# Altium project IncuNest.PrjPcb
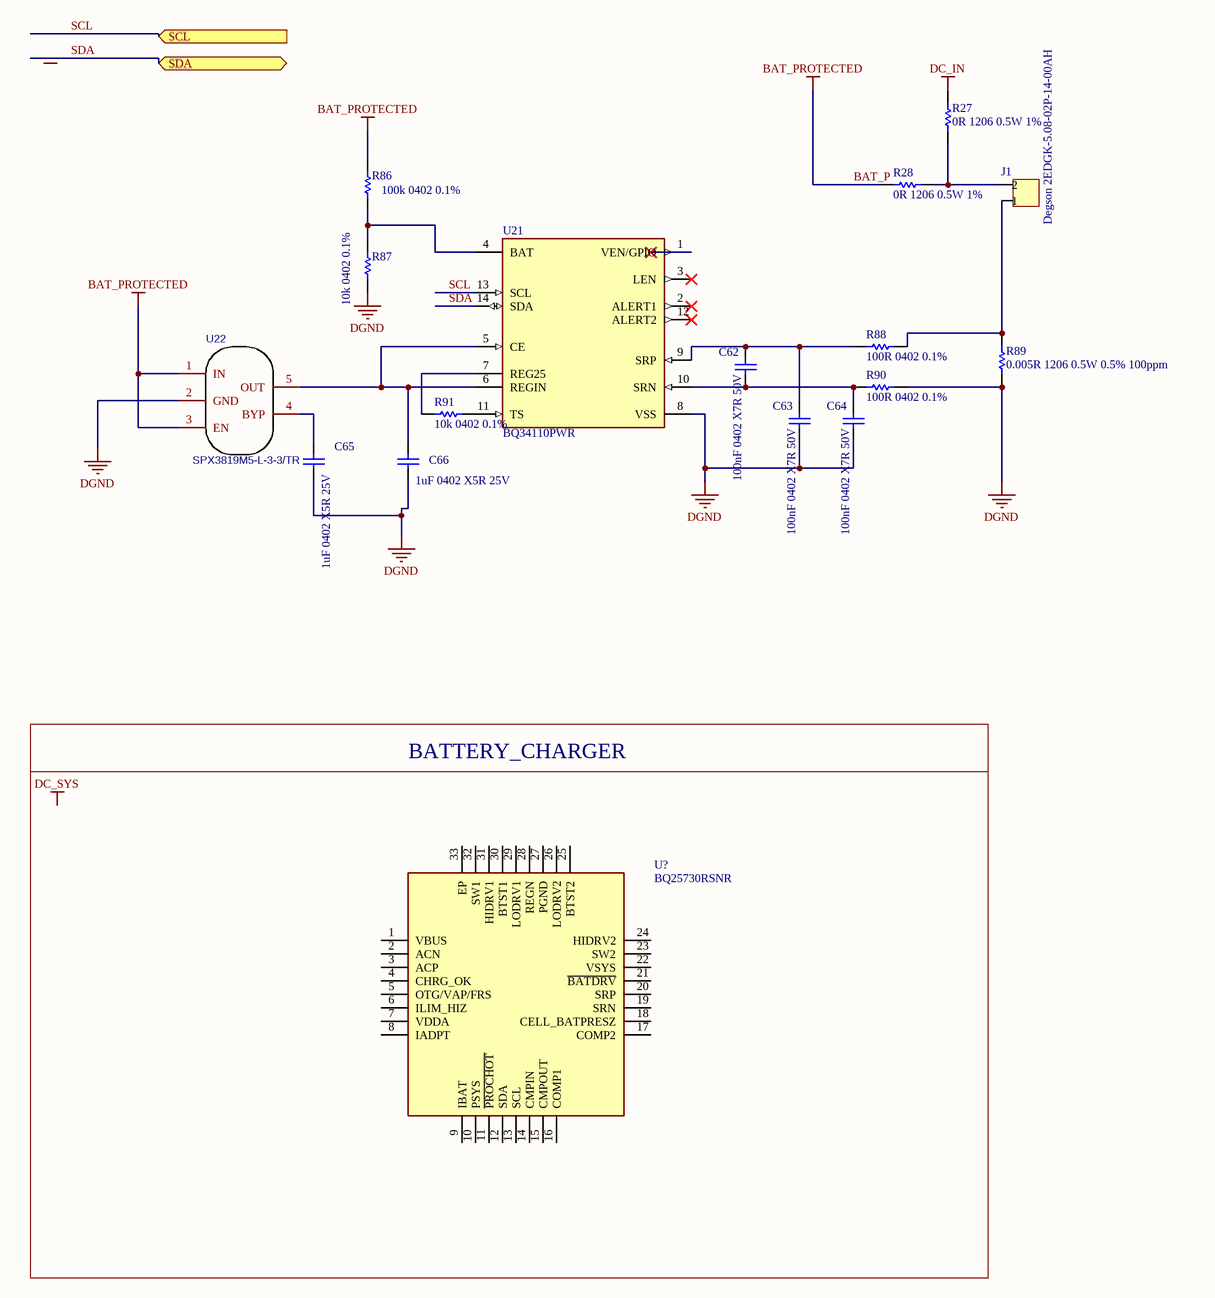
[diagram p0: Battery.SchDoc]
Author_in3: Pablo Sanchez Bergasa; SheetTotal_in3: 10
6 sheets, 122 parts. Net scope: flat (ports and power ports of the same name join across sheets).
Board file: Motherboard.PcbDoc
Sheets:
  Battery.SchDoc
  Power_management.SchDoc
  AFE.SchDoc
  GSM.SchDoc
  Sensors.SchDoc
  Display.SchDoc

## Sheet Battery.SchDoc: Power
size A3; SheetNumber: 4; SheetTotal: 11

### Parts
(Parts that share a designator on the sheet are numbered #1, #2 ... from top to bottom, then left to right.)
C62  100nF 0402 X7R 50V  [CAPC1005X55X25NL5T10]
C63  100nF 0402 X7R 50V  [CAPC1005X55X25NL5T10]
C64  100nF 0402 X7R 50V  [CAPC1005X55X25NL5T10]
C65  1uF 0402 X5R 25V  [CAPC1005X55X25NL5T10]
C66  1uF 0402 X5R 25V  [CAPC1005X55X25NL5T10]
J1  Degson 2EDGK-5.08-02P-14-00AH  [PCB-h4cyb3wxd4gf7j132tzl-1]
R27  0R 1206 0.5W 1%  [CAPC3216X180X55ML20T25]
R28  0R 1206 0.5W 1%  [CAPC3216X180X55ML20T25]
R86  100k 0402 0.1%  [RESC1005X40X25ML05T10]
R87  10k 0402 0.1%  [RESC1005X40X25ML05T10]
R88  100R 0402 0.1%  [RESC1005X40X25ML05T10]
R89  0.005R 1206 0.5W 0.5% 100ppm  [CAPC3216X180X55ML20T25]
R90  100R 0402 0.1%  [RESC1005X40X25ML05T10]
R91  10k 0402 0.1%  [RESC1005X40X25ML05T10]
U21  BQ34110PWR  [FP-PW0014A-MFG]
U22  SPX3819M5-L-3-3/TR  [SOT-23-5_L3.0-W1.7-P0.95-LS2.8-BR]
U?#1  BQ25730RSNR  [QFN40P400X400X80-33N-D]

### Blocks framed on the sheet
BATTERY_CHARGER: U?#1

### Ports
SCL (in), SDA (bidir)

### Nets
BAT_P: R28.1 R86.2 U22.1(IN) U22.3(EN)  [also labelled BAT_PROTECTED]
DC_IN: R27.1
DGND: C63.1 C64.1 C65.1 C66.1 R87.1 R89.2 R90.1 U21.8(VSS) U22.2(GND)
SCL: U21.13(SCL) ; port SCL
SDA: U21.14(SDA) ; port SDA
NetC62_1: C62.1 C64.2 R90.2 U21.10(SRN)
NetC62_2: C62.2 C63.2 R88.2 U21.9(SRP)
NetC65_2: C65.2 U22.4(BYP)
NetC66_2: C66.2 U21.5(CE) U21.6(REGIN) U22.5(OUT)
NetJ1_1: J1.1 R88.1 R89.1
NetJ1_2: J1.2 R27.2 R28.2
NetR86_1: R86.1 R87.2 U21.4(BAT)
NetR91_1: R91.1 U21.11(TS)
NetR91_2: R91.2 U21.7(REG25)

Not connected (* = marked no-connect by the designer): U21 1(VEN/GPIO)* 2(ALERT1)* 3(LEN)* 12(ALERT2)*; U?#1 1(VBUS) 2(ACN) 3(ACP) 4(CHRG_OK) 5(OTG/VAP/FRS) 6(ILIM_HIZ) 7(VDDA) 8(IADPT) 9(IBAT) 10(PSYS) 11(~{PROCHOT}) 12(SDA) 13(SCL) 14(CMPIN) 15(CMPOUT) 16(COMP1) 17(COMP2) 18(CELL_BATPRESZ) 19(SRN) 20(SRP) 21(~{BATDRV}) 22(VSYS) 23(SW2) 24(HIDRV2) 25(BTST2) 26(LODRV2) 27(PGND) 28(REGN) 29(LODRV1) 30(BTST1) 31(HIDRV1) 32(SW1) 33(EP)

### Notes on the sheet
- Labels drawn without touching a wire or pin: DC_SYS
- Title
- Size:
- Date:
- A3
- Author:
- Time:
- Revision:
- Sheet
- of
- File:

### Library data of the parts
C62-C66 = CMP-1662-00020-1: ComponentLink2Description: Datasheet; ComponentLink2URL: http://psearch.en.murata.com/capacitor/product/GRM155R60J105KE19%23.pdf; ComponentLink1Description: Manufacturer URL; ComponentLink1URL: http://www.murata.com/
  C62-C64: LCSC_PN: C77020
  C65 C66: LCSC_PN: C77009
J1 = CMP-7a42b7ee166ba585-1: Terminal block, 5mm 2 Pos, through hole male.; Manufacturer Part Number: 2EDGK-5.08-02P-14-00AH + 2EDGVC-5.08-02P; Octopart URL: https://octopart.com/2edgk-5.08-02p-14-00ah-degson-78006607; OctopartID: 7a42b7ee166ba585; Manufacturer Part Number 2: WJ2EDGVC-5.08-2P + WJ2EDGK-5.08-2P; LCSC Part: C8445; LCSC_PN: C8445
R27 R28 = CMP-0abdc173b10ad57a-1: Manufacturer Part Number: WSLP12065L000FEA; Resistance: 0,002; Power: 1W; Octopart URL: https://octopart.com/1-2176055-0-te+connectivity-46440145; Case/Package: 1206; Lifecycle Status: Not Listed by Manufacturer; Packaging: Tape & Reel (TR); OctopartID: 0abdc173b10ad57a; OrderingCode: WSLP12065L000FEA; Manufacturer Part Number 2: FMF06FTHR005-LHL; LCSC_PN: C108081
R86-R88 R90 R91 = CMP-2002-07472-1
  R86: LCSC_PN: C60491
  R87 R91: LCSC_PN: C190095
  R88 R90: LCSC_PN: C106233
R89 = CMP-0abdc173b10ad57a-1: 0.002R 1206 0.5W 1%; Manufacturer Part Number: WSLP12065L000FEA; Resistance: 0,005; Power: 1W; Octopart URL: https://octopart.com/1-2176055-0-te+connectivity-46440145; Case/Package: 1206; Lifecycle Status: Not Listed by Manufacturer; Packaging: Tape & Reel (TR); OctopartID: 0abdc173b10ad57a; OrderingCode: WSLP12065L000FEA; Manufacturer Part Number 2: FMF06FTHR005-LHL; LCSC_PN: C723507
U21 = CMP-04911-000003-1: IC BATT MON MULTICELL 14TSSOP; Manufacturer: Texas Instruments; Number Of Outputs: 2; Max Junction Temp: +100°C; Max Supply Voltage: 4.5V; Min Supply Voltage: 2.45V; Number Of Cells: 4; Standoff Height: 0.05mm; Nominal Supply Current: 133uA; Package: PW0014A; Temperature Range High: +85°C; Octopart: https://octopart.com/bq34110pwr-texas+instruments-75529711; ComponentLink2URL: https://www.ti.com/lit/ds/symlink/bq34110.pdf; Device Class L1: Integrated Circuits (ICs); Height: 1.2mm; Device Class L3: Battery Management; Temperature Range Low: -40°C; RoHS: TRUE; Digikey Description: IC BATT MON MULTICELL 14TSSOP; Device Class L2: Power Management ICs; Manufacturer Part Number: BQ34110PWR; Lead Free: Yes; ComponentLink2Description: Datasheet; Category: IC; Automotive: No; Mouser Description: Multi-Chemistry High-Cell Count Battery Fuel Gauge With Integrated Rarely Discharged Module 14-TSSOP -40 to 85; Temperature: -40°C to +85°C; Ambient Temperature Range Low: -40°C; Ambient Temperature Range High: +85°C; LCSC_PN: C2877075
U22 = SPX3819M5-L-3-3/TR: BOM_Manufacturer: EXAR; BOM_Supplier: LCSC; BOM_Manufacturer Part: SPX3819M5-L-3-3/TR; BOM_Supplier Part: C9055; BOM_JLCPCB Part Class: Extended Part; spicePre: U; spiceSymbolName: SPX3819M5-L-3-3/TR; LCSC_PN: C9055
U?#1 = BQ25730RSNR: Integrated Circuit; Manufacturer_Name: Texas Instruments; Datasheet Link: https://www.ti.com/lit/ds/symlink/bq25730.pdf?ts=1623420063043&ref_url=https%253A%252F%252Fwww.ti.com%252Fstore%252Fti%252Fen%252Fp%252Fproduct%252F%253Fp%253DBQ25730RSNR; Height: 0.8mm; Manufacturer_Part_Number: BQ25730RSNR; Mouser Part Number: 595-BQ25730RSNR; Mouser Price/Stock: https://www.mouser.co.uk/ProductDetail/Texas-Instruments/BQ25730RSNR?qs=stqOd1AaK78USmb51n%2Fwlg%3D%3D; Arrow Part Number: BQ25730RSNR; Arrow Price/Stock: https://www.arrow.com/en/products/bq25730rsnr/texas-instruments?region=nac

## Sheet Power_management.SchDoc: Power
size A3; SheetNumber: 4; SheetTotal: 10
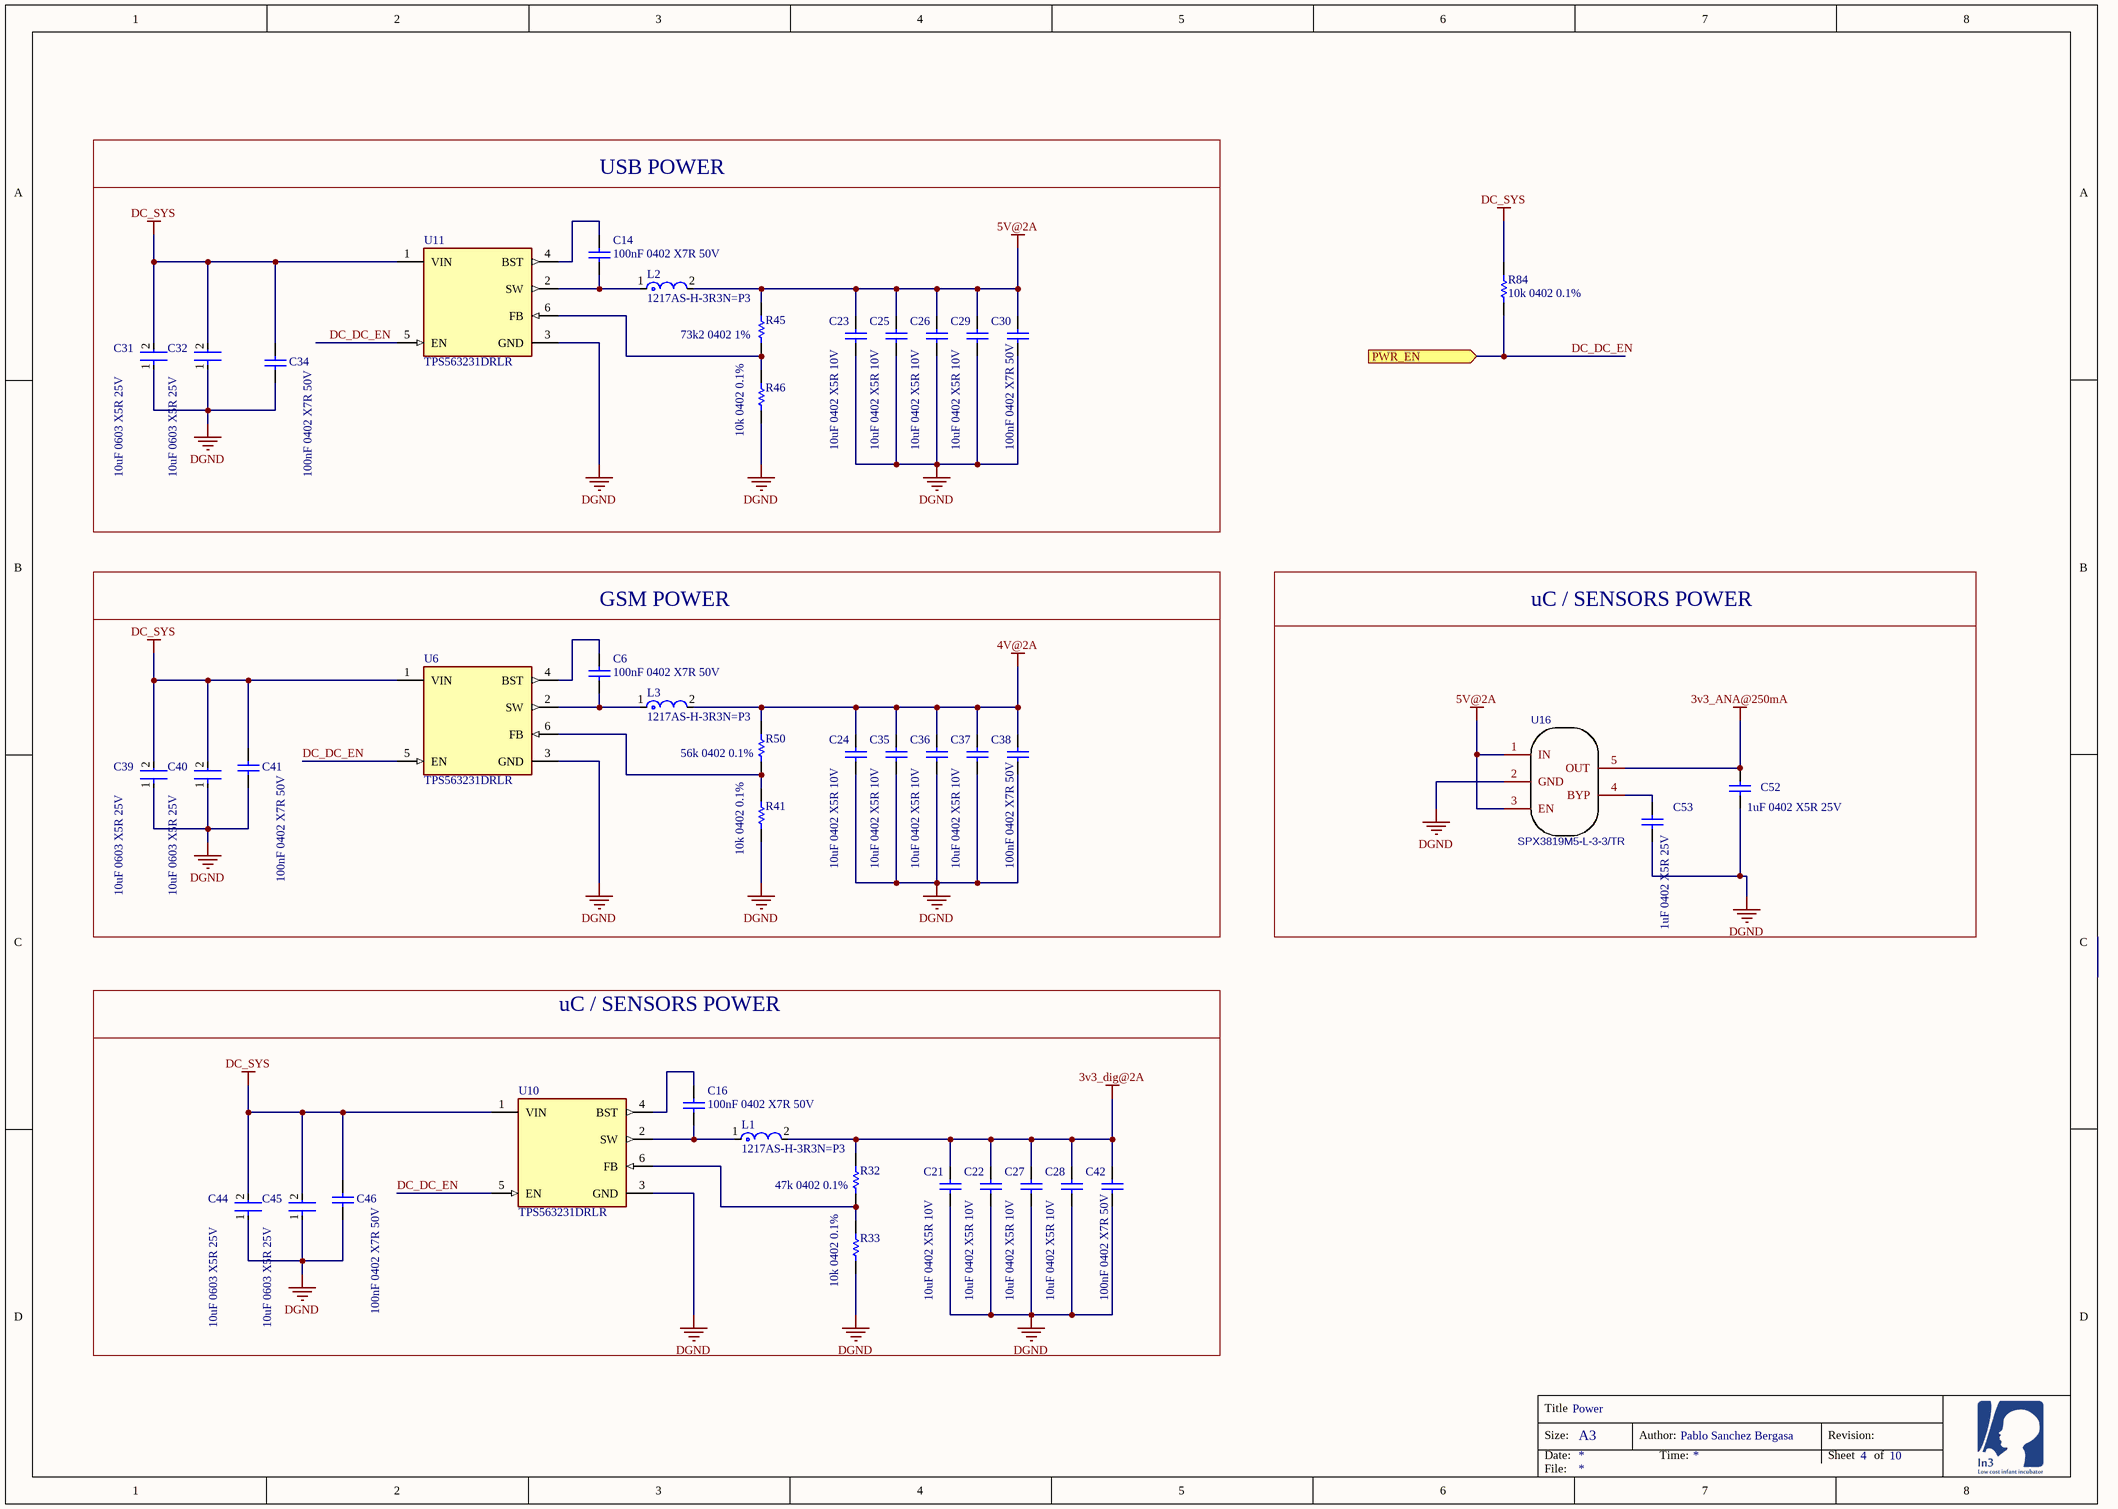
[diagram p1: Power_management.SchDoc]

### Parts
C6  100nF 0402 X7R 50V  [CAPC1005X55X25NL5T10]
C14  100nF 0402 X7R 50V  [CAPC1005X55X25NL5T10]
C16  100nF 0402 X7R 50V  [CAPC1005X55X25NL5T10]
C21  10uF 0402 X5R 10V  [CAPC1005X55X25NL5T10]
C22  10uF 0402 X5R 10V  [CAPC1005X55X25NL5T10]
C23  10uF 0402 X5R 10V  [CAPC1005X55X25NL5T10]
C24  10uF 0402 X5R 10V  [CAPC1005X55X25NL5T10]
C25  10uF 0402 X5R 10V  [CAPC1005X55X25NL5T10]
C26  10uF 0402 X5R 10V  [CAPC1005X55X25NL5T10]
C27  10uF 0402 X5R 10V  [CAPC1005X55X25NL5T10]
C28  10uF 0402 X5R 10V  [CAPC1005X55X25NL5T10]
C29  10uF 0402 X5R 10V  [CAPC1005X55X25NL5T10]
C30  100nF 0402 X7R 50V  [CAPC1005X55X25NL5T10]
C31  10uF 0603 X5R 25V  [FP-GRM188-0_2-IPC_B]
C32  10uF 0603 X5R 25V  [FP-GRM188-0_2-IPC_B]
C34  100nF 0402 X7R 50V  [CAPC1005X55X25NL5T10]
C35  10uF 0402 X5R 10V  [CAPC1005X55X25NL5T10]
C36  10uF 0402 X5R 10V  [CAPC1005X55X25NL5T10]
C37  10uF 0402 X5R 10V  [CAPC1005X55X25NL5T10]
C38  100nF 0402 X7R 50V  [CAPC1005X55X25NL5T10]
C39  10uF 0603 X5R 25V  [FP-GRM188-0_2-IPC_B]
C40  10uF 0603 X5R 25V  [FP-GRM188-0_2-IPC_B]
C41  100nF 0402 X7R 50V  [CAPC1005X55X25NL5T10]
C42  100nF 0402 X7R 50V  [CAPC1005X55X25NL5T10]
C44  10uF 0603 X5R 25V  [FP-GRM188-0_2-IPC_B]
C45  10uF 0603 X5R 25V  [FP-GRM188-0_2-IPC_B]
C46  100nF 0402 X7R 50V  [CAPC1005X55X25NL5T10]
C52  1uF 0402 X5R 25V  [CAPC1005X55X25NL5T10]
C53  1uF 0402 X5R 25V  [CAPC1005X55X25NL5T10]
L1  1217AS-H-3R3N=P3  [FP-DEM8045C-MFG]
L2  1217AS-H-3R3N=P3  [FP-DEM8045C-MFG]
L3  1217AS-H-3R3N=P3  [FP-DEM8045C-MFG]
R32  47k 0402 0.1%  [RESC1005X40X25ML05T10]
R33  10k 0402 0.1%  [RESC1005X40X25ML05T10]
R41  10k 0402 0.1%  [RESC1005X40X25ML05T10]
R45  73k2 0402 1%  [RESC1005X40X25ML05T10]
R46  10k 0402 0.1%  [RESC1005X40X25ML05T10]
R50  56k 0402 0.1%  [RESC1005X40X25ML05T10]
R84  10k 0402 0.1%  [RESC1005X40X25ML05T10]
U6  TPS563231DRLR  [FP-DRL0006A-MFG]
U10  TPS563231DRLR  [FP-DRL0006A-MFG]
U11  TPS563231DRLR  [FP-DRL0006A-MFG]
U16  SPX3819M5-L-3-3/TR  [SOT-23-5_L3.0-W1.7-P0.95-LS2.8-BR]

### Blocks framed on the sheet
USB POWER: C14 C23 C25 C26 C29-C32 C34 L2 R45 R46 U11
GSM POWER: C6 C24 C35-C41 L3 R41 R50 U6
uC / SENSORS POWER: C52 C53 U16
uC / SENSORS POWER: C16 C21 C22 C27 C28 C42 C44-C46 L1 R32 R33 U10

### Ports
PWR_EN (in)

### Nets
3v3_ANA@250mA: C52.2 U16.5(OUT)
3v3_dig@2A: C21.2 C22.2 C27.2 C28.2 C42.2 L1.2 R32.2
4V@2A: C24.2 C35.2 C36.2 C37.2 C38.2 L3.2 R50.2
5V@2A: C23.2 C25.2 C26.2 C29.2 C30.2 L2.2 R45.2 U16.1(IN) U16.3(EN)
DC_SYS: C31.2 C32.2 C34.2 C39.2 C40.2 C41.2 C44.2 C45.2 C46.2 R84.1 U6.1(VIN) U10.1(VIN) U11.1(VIN)
DGND: C21.1 C22.1 C23.1 C24.1 C25.1 C26.1 C27.1 C28.1 C29.1 C30.1 C31.1 C32.1 C34.1 C35.1 C36.1 C37.1 C38.1 C39.1 C40.1 C41.1 C42.1 C44.1 C45.1 C46.1 C52.1 C53.1 R33.1 R41.1 R46.1 U6.3(GND) U10.3(GND) U11.3(GND) U16.2(GND)
DC_DC_EN: R84.2 U6.5(EN) U10.5(EN) U11.5(EN) ; port PWR_EN
NetC6_1: C6.1 L3.1 U6.2(SW)
NetC6_2: C6.2 U6.4(BST)
NetC14_1: C14.1 L2.1 U11.2(SW)
NetC14_2: C14.2 U11.4(BST)
NetC16_1: C16.1 L1.1 U10.2(SW)
NetC16_2: C16.2 U10.4(BST)
NetC53_2: C53.2 U16.4(BYP)
NetR32_1: R32.1 R33.2 U10.6(FB)
NetR41_2: R41.2 R50.1 U6.6(FB)
NetR45_1: R45.1 R46.2 U11.6(FB)

### Notes on the sheet
- Title
- Size:
- Date:
- A3
- Author:
- Time:
- Revision:
- Sheet
- of
- File:

### Library data of the parts
C6 C14 C16 C21-C30 C34-C38 C41 C42 C46 C52 C53 = CMP-1662-00020-1: ComponentLink2Description: Datasheet; ComponentLink2URL: http://psearch.en.murata.com/capacitor/product/GRM155R60J105KE19%23.pdf; ComponentLink1Description: Manufacturer URL; ComponentLink1URL: http://www.murata.com/
  C6 C14 C16 C30 C34 C38 C41 C42 C46: LCSC_PN: C77020
  C21-C29 C35-C37: LCSC_PN: C77000
  C52 C53: LCSC_PN: C77009
C31 C32 C39 C40 C44 C45 = CMP-06035-022879-1: LCSC_PN: C91606
L1-L3 = CMP-06042-006799-1: Shielded Wirewound Inductor 3.3uH 30% 6800mA 0.0144Ω SMD; Saturation Current: 7.7A; Core Material: Ferrite; Current Rating: 6.8A; Test Frequency: 100kHz; DC Resistance (DCR): 14.4mR; Height - Seated (Max): 0.177inch; Packaging: Tape and Reel; Resistor Type: Wirewound; Tolerance: 30%; Inductance: 3.3uH; Length: 0.315inch; Number of Pins: 2; Case/Package: SMD/SMT; Mount: Surface Mount; Max DC Current: 6.8A; Width: 0.315inch; Shielding: Shielded; LCSC_PN: C514864
R32 R33 R41 R46 R50 R84 = CMP-2002-07472-1
  R32: LCSC_PN: C93943
  R33 R41 R46 R84: LCSC_PN: C190095
  R50: LCSC_PN: C114756
R45 = CMP-2002-07472-1: Manufacturer: Yageo / Phycomp; LCSC_PN: C185398
U6 U10 U11 = CMP-04918-000435-1: POWER MANAGEMENT; LCSC_PN: C779412
U16 = SPX3819M5-L-3-3/TR: BOM_Manufacturer: EXAR; BOM_Supplier: LCSC; BOM_Manufacturer Part: SPX3819M5-L-3-3/TR; BOM_Supplier Part: C9055; BOM_JLCPCB Part Class: Extended Part; spicePre: U; spiceSymbolName: SPX3819M5-L-3-3/TR; LCSC_PN: C9055

## Sheet AFE.SchDoc
size A3; SheetNumber: 7; SheetTotal: 10
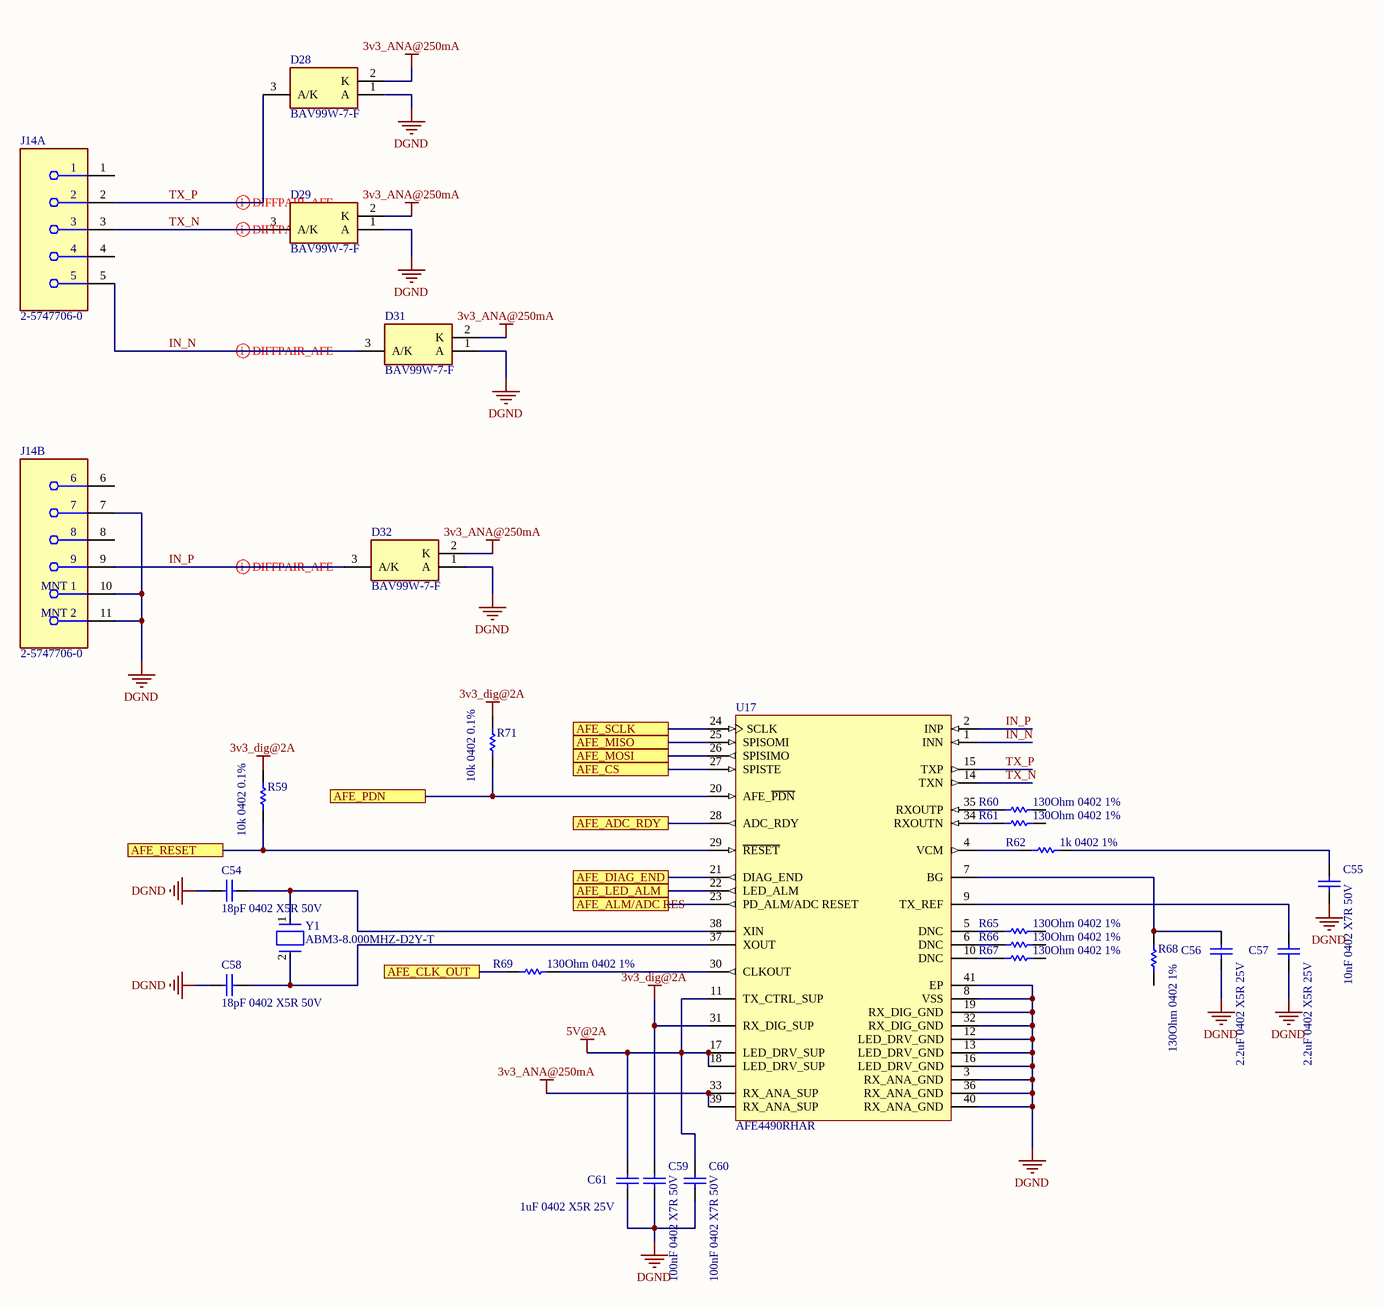
[diagram p2: AFE.SchDoc]

### Parts
C54  18pF 0402 X5R 50V  [CAPC1005X55X25NL5T10]
C55  10nF 0402 X7R 50V  [CAPC1005X55X25NL5T10]
C56  2.2uF 0402 X5R 25V  [CAPC1005X55X25NL5T10]
C57  2.2uF 0402 X5R 25V  [CAPC1005X55X25NL5T10]
C58  18pF 0402 X5R 50V  [CAPC1005X55X25NL5T10]
C59  100nF 0402 X7R 50V  [CAPC1005X55X25NL5T10]
C60  100nF 0402 X7R 50V  [CAPC1005X55X25NL5T10]
C61  1uF 0402 X5R 25V  [CAPC1005X55X25NL5T10]
D28  BAV99W-7-F  [SOT65P210X110-3N]
D29  BAV99W-7-F  [SOT65P210X110-3N]
D31  BAV99W-7-F  [SOT65P210X110-3N]
D32  BAV99W-7-F  [SOT65P210X110-3N]
J14  2-5747706-0  [FP-2-5747706-0-MFG]  (parts A,B of 2)
R59  10k 0402 0.1%  [RESC1005X40X25ML05T10]
R60  130Ohm 0402 1%  [RESC1005X40X25ML05T10]
R61  130Ohm 0402 1%  [RESC1005X40X25ML05T10]
R62  1k 0402 1%  [RESC1005X40X25ML05T10]
R65  130Ohm 0402 1%  [RESC1005X40X25ML05T10]
R66  130Ohm 0402 1%  [RESC1005X40X25ML05T10]
R67  130Ohm 0402 1%  [RESC1005X40X25ML05T10]
R68  130Ohm 0402 1%  [RESC1005X40X25ML05T10]
R69  130Ohm 0402 1%  [RESC1005X40X25ML05T10]
R71  10k 0402 0.1%  [RESC1005X40X25ML05T10]
U17  AFE4490RHAR  [RHA0040B_V]
Y1  ABM3-8.000MHZ-D2Y-T  [FP-ABM3-MFG]

### Ports
AFE_ADC_RDY, AFE_ALM/ADC RES, AFE_CLK_OUT, AFE_CS, AFE_DIAG_END, AFE_LED_ALM, AFE_MISO, AFE_MOSI, AFE_PDN, AFE_RESET, AFE_SCLK

### Nets
3v3_ANA@250mA: D28.2(K) D29.2(K) D31.2(K) D32.2(K) U17.33(RX_ANA_SUP) U17.39(RX_ANA_SUP)
3v3_dig@2A: C59.2 R59.2 R71.2 U17.31(RX_DIG_SUP)
5V@2A: C60.2 C61.2 U17.11(TX_CTRL_SUP) U17.17(LED_DRV_SUP) U17.18(LED_DRV_SUP)
DGND: C54.1 C55.1 C56.1 C57.1 C58.1 C59.1 C60.1 C61.1 D28.1(A) D29.1(A) D31.1(A) D32.1(A) J14.7 J14.10(MNT_1) J14.11(MNT_2) U17.3(RX_ANA_GND) U17.8(VSS) U17.12(LED_DRV_GND) U17.13(LED_DRV_GND) U17.16(LED_DRV_GND) U17.19(RX_DIG_GND) U17.32(RX_DIG_GND) U17.36(RX_ANA_GND) U17.40(RX_ANA_GND) U17.41(EP)
IN_N: D31.3(A/K) J14.5 U17.1(INN)
IN_P: D32.3(A/K) J14.9 U17.2(INP)
TX_N: D29.3(A/K) J14.3 U17.14(TXN)
TX_P: D28.3(A/K) J14.2 U17.15(TXP)
NetC54_2: C54.2 U17.38(XIN) Y1.1
NetC55_2: C55.2 R62.1
NetC56_2: C56.2 R68.2 U17.7(BG)
NetC57_2: C57.2 U17.9(TX_REF)
NetC58_2: C58.2 U17.37(XOUT) Y1.2
NetR59_1: R59.1 U17.29(~{RESET}) ; port AFE_RESET
NetR60_2: R60.2 U17.35(RXOUTP)
NetR61_2: R61.2 U17.34(RXOUTN)
NetR62_2: R62.2 U17.4(VCM)
NetR65_2: R65.2 U17.5(DNC)
NetR66_2: R66.2 U17.6(DNC)
NetR67_2: R67.2 U17.10(DNC)
NetR69_1: R69.1 U17.30(CLKOUT)
NetR69_2: R69.2 ; port AFE_CLK_OUT
NetR71_1: R71.1 U17.20(AFE_~{PDN}) ; port AFE_PDN
NetU17_21: U17.21(DIAG_END) ; port AFE_DIAG_END
NetU17_22: U17.22(LED_ALM) ; port AFE_LED_ALM
NetU17_23: U17.23(PD_ALM/ADC_RESET) ; port AFE_ALM/ADC RES
NetU17_24: U17.24(SCLK) ; port AFE_SCLK
NetU17_25: U17.25(SPISOMI) ; port AFE_MISO
NetU17_26: U17.26(SPISIMO) ; port AFE_MOSI
NetU17_27: U17.27(SPISTE) ; port AFE_CS
NetU17_28: U17.28(ADC_RDY) ; port AFE_ADC_RDY

Not connected (* = marked no-connect by the designer): J14 1 4 6 8; R60 1; R61 1; R65 1; R66 1; R67 1; R68 1

### Layout directives
differential pair; differential pair class AFE: IN_N, IN_P, TX_N, TX_P

### Library data of the parts
C54-C61 = CMP-1662-00020-1: ComponentLink2Description: Datasheet; ComponentLink2URL: http://psearch.en.murata.com/capacitor/product/GRM155R60J105KE19%23.pdf; ComponentLink1Description: Manufacturer URL; ComponentLink1URL: http://www.murata.com/
  C54 C58: LCSC_PN: C33149
  C55: LCSC_PN: C60133
  C56 C57: LCSC_PN: C77002
  C59 C60: LCSC_PN: C77020
  C61: LCSC_PN: C77009
D28 D29 D31 D32 = BAV99W-7-F: Diode; Manufacturer_Name: Diodes Inc.; Datasheet Link: https://www.diodes.com/assets/Datasheets/ds30045.pdf; Height: 1.1mm; Manufacturer_Part_Number: BAV99W-7-F; Mouser Part Number: 621-BAV99W-F; Mouser Price/Stock: https://www.mouser.co.uk/ProductDetail/Diodes-Incorporated/BAV99W-7-F?qs=KrBKXozF1ElcNxS3QKF7wg%3D%3D; Arrow Part Number: BAV99W-7-F; Arrow Price/Stock: https://www.arrow.com/en/products/bav99w-7-f/diodes-incorporated?region=europe; LCSC_PN: C93035
J14 = CMP-03367-000004-1: CONN D-SUB RCPT 9POS VERT SOLDER; Manufacturer: TE Connectivity; Is Female: yes; Conn Orientation: Vertical; Current Rating: 6A; Shielding: true; Number Of Contacts: 9; Conn Gender: Female; Pitch: 2.74mm; RoHS: TRUE; Temperature: -55°C to +105°C; Package: 2-5747706-0; Category: Conn; Automotive: No; Device Class L3: unset; Octopart: https://octopart.com/2-5747706-0-te+connectivity-39499683; Lead Free: Yes; Contact Material: Gold,Nickel; Height: 0.494inch; Temperature Range High: +105°C; Device Class L1: Connectors; ComponentLink2Description: Datasheet; Mouser Description: D-Sub Standard Connectors RECP FRNT MTL SHL 9P retention inserts; ComponentLink2URL: https://www.te.com/commerce/DocumentDelivery/DDEController?Action=showdoc&DocId=Customer+Drawing%7F5747706%7FB%7Fpdf%7FEnglish%7FENG_CD_5747706_B.pdf%7F2-5747706-0; Digikey Description: CONN D-SUB RCPT 9POS VERT SOLDER; Temperature Range Low: -55°C; Manufacturer Part Number: 2-5747706-0; Device Class L2: D-Sub Connectors; LCSC_PN: C189689
R59-R62 R65-R69 R71 = CMP-2002-07472-1
  R59 R71: LCSC_PN: C190095
  R60 R61 R65-R69: LCSC_PN: C413066
  R62: LCSC_PN: C106235
U17 = CMP-0767-00003-2: Integrated Analog Front End for Pulse Oximeter, 2 to 3.6 V Rx, 3 to 5.25 V Tx, -40 to 85 degC, 40-Pin VQFN (RHA), RoHS, Tape and Reel; Manufacturer: Texas Instruments; CMRR: 75 dB; Resolution: 22 Bits; Sample Rate (max): 1.3 KSPS; Packing: RHA0040B; # Input Channels: 1; ComponentLink3Description: Package Specification; ComponentLink2Description: Datasheet; RoHS: TRUE; ComponentLink2URL: http://www.ti.com/lit/ds/symlink/afe4490.pdf; ComponentLink1Description: Manufacturer URL; DatasheetVersion: SBAS602F; AFE Digital Supply: 2 to 3.6 V; ComponentLink1URL: http://www.ti.com/; PartNumber: AFE4490RHAR; PackageVersion: 4204276/E; Operating Temperature Range: -40 to 85 degC; PackageReference: RHA-40; PackageDescription: 40-Pin Plastic Quad Flatpack No-Lead, Body 6 x 6 mm, Pitch 0.5 mm; Transmit Controller Supply: 3 to 5.25 V; ComponentLink3URL: http://www.ti.com.cn/cn/lit/ml/mpqf135c/mpqf135c.pdf; AFE Analog Supply: 2 to 3.6 V; Mounting Technology: Surface Mount; LCSC_PN: C2651608
Y1 = CMP-2000-05033-2: Crystal 8MHz ±20ppm 18pF SMD-2 5mm x 3.2mm; Series Resistance: 500R; Frequency Stability: 30ppm; ESR (Equivalent Series Resistance): 140R; Load Capacitance: 18pF; Height: 0.051inch; Tolerance: 20ppm; Depth: 3.2mm; Max Operating Temperature: 85°C; Frequency: 8MHz; Termination: SMD/SMT; Lead Free: Lead Free; Number of Pins: 2; Width: 3.2mm; RoHS Compliant: Yes; Resistor Type: Ceramic; Length: 5mm; Mount: Surface Mount; Case/Package: CSMD; Package Quantity: 1000; Radiation Hardening: No; Min Operating Temperature: -40°C; Packaging: Tape and Reel; Frequency Tolerance: 20ppm; LCSC_PN: C144380

## Sheet GSM.SchDoc: GSM
size A4; SheetNumber: 9; SheetTotal: 10
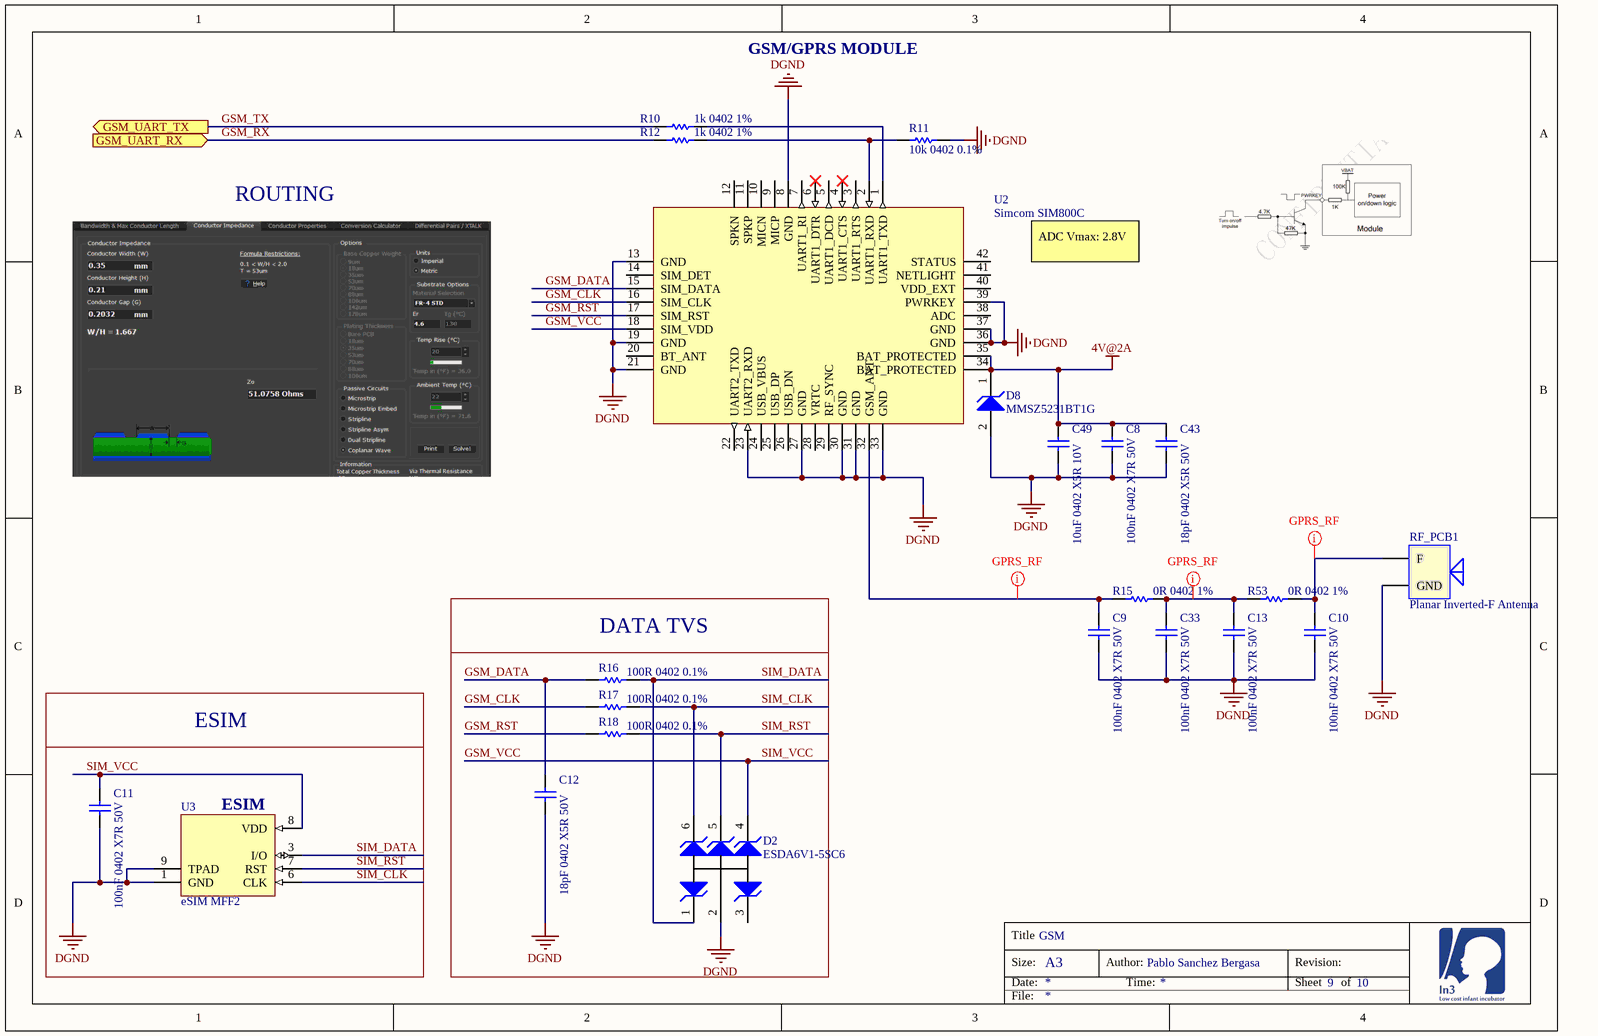
[diagram p3: GSM.SchDoc]

### Parts
C8  100nF 0402 X7R 50V  [CAPC1005X55X25NL5T10]
C9  100nF 0402 X7R 50V  [CAPC1005X55X25NL5T10]
C10  100nF 0402 X7R 50V  [CAPC1005X55X25NL5T10]
C11  100nF 0402 X7R 50V  [CAPC1005X55X25NL5T10]
C12  18pF 0402 X5R 50V  [CAPC1005X55X25NL5T10]
C13  100nF 0402 X7R 50V  [CAPC1005X55X25NL5T10]
C33  100nF 0402 X7R 50V  [CAPC1005X55X25NL5T10]
C43  18pF 0402 X5R 50V  [CAPC1005X55X25NL5T10]
C49  10uF 0402 X5R 10V  [CAPC1005X55X25NL5T10]
D2  ESDA6V1-5SC6  [MF06A_N]
D8  MMSZ5231BT1G  [ONSC-SOD-123-2-425-04_V]
R10  1k 0402 1%  [RESC1005X40X25ML05T10]
R11  10k 0402 0.1%  [RESC1005X40X25ML05T10]
R12  1k 0402 1%  [RESC1005X40X25ML05T10]
R15  0R 0402 1%  [RESC1005X40X25ML05T10]
R16  100R 0402 0.1%  [RESC1005X40X25ML05T10]
R17  100R 0402 0.1%  [RESC1005X40X25ML05T10]
R18  100R 0402 0.1%  [RESC1005X40X25ML05T10]
R53  0R 0402 1%  [RESC1005X40X25ML05T10]
RF_PCB1  Planar Inverted-F Antenna  [PCB-k9titb4465gfk1ijwrnj-1]  (no BOM)
U2  Simcom SIM800C  [SIM800C]
U3  eSIM MFF2  [SON127P600X95_HS-9N]

### Blocks framed on the sheet
DATA TVS: C12 D2 R16-R18
ESIM: C11 U3

### Ports
GSM_UART_RX (in), GSM_UART_TX (out)

### Nets
4V@2A: C8.2 C43.2 C49.2 D8.1(K) U2.34(BAT_PROTECTED) U2.35(BAT_PROTECTED)
DGND: C8.1 C9.1 C10.1 C11.1 C12.1 C13.1 C33.1 C43.1 C49.1 D2.2(K) D8.2(A) R11.1 RF_PCB1.2(GND) U2.8(GND) U2.13(GND) U2.19(GND) U2.21(GND) U2.23(UART2_RXD) U2.27(GND) U2.30(GND) U2.31(GND) U2.33(GND) U2.36(GND) U2.37(GND) U2.39(PWRKEY) U3.1(GND) U3.9(TPAD)
GSM_CLK: R17.2 U2.16(SIM_CLK)
GSM_DATA: C12.2 R16.2 U2.15(SIM_DATA)
GSM_RST: R18.2 U2.17(SIM_RST)
GSM_RX: R12.2 ; port GSM_UART_RX
GSM_TX: R10.2 ; port GSM_UART_TX
GSM_VCC: C11.2 D2.4(A) U2.18(SIM_VDD) U3.8(VDD)  [also labelled SIM_VCC]
SIM_CLK: D2.6(A) R17.1 U3.6(CLK)
SIM_DATA: D2.1(K) R16.1 U3.3(I/O)
SIM_RST: D2.5(A) R18.1 U3.7(RST)
NetC9_2: C9.2 R15.2 U2.32(GSM_ANT)
NetC10_2: C10.2 R53.1 RF_PCB1.1(F)
NetC13_2: C13.2 C33.2 R15.1 R53.2
NetR10_1: R10.1 U2.1(UART1_TXD)
NetR11_2: R11.2 R12.1 U2.2(UART1_RXD)

Not connected (* = marked no-connect by the designer): D2 3(K); U2 3(UART1_RTS) 4(UART1_CTS)* 5(UART1_DCD) 6(UART1_DTR)* 7(UART1_RI) 9(MICP) 10(MICN) 11(SPKP) 12(SPKN) 14(SIM_DET) 20(BT_ANT) 22(UART2_TXD) 24(USB_VBUS) 25(USB_DP) 26(USB_DN) 28(VRTC) 29(RF_SYNC) 38(ADC) 40(VDD_EXT) 41(NETLIGHT) 42(STATUS)

### Layout directives
net class GPRS_RF: NetC9_2, NetC10_2, NetC13_2

### Notes on the sheet
- GSM/GPRS MODULE
- ROUTING
- ADC Vmax: 2.8V
- (near U3) ESIM
- Title
- Size:
- Date:
- A3
- Author:
- Time:
- Revision:
- Sheet
- of
- File:

### Library data of the parts
C8-C13 C33 C43 C49 = CMP-1662-00020-1: ComponentLink2Description: Datasheet; ComponentLink2URL: http://psearch.en.murata.com/capacitor/product/GRM155R60J105KE19%23.pdf; ComponentLink1Description: Manufacturer URL; ComponentLink1URL: http://www.murata.com/
  C8-C11 C13 C33: LCSC_PN: C77020
  C12 C43: LCSC_PN: C33149
  C49: LCSC_PN: C77000
D2 = CMP-924f5b40f9684d88-1: ESDA Series 5 Channel 6.1 V 50 pF SMT Uni Directional Transil Array - SOT-23-6L; Operating Voltage: 6.10 V; Power Rating: 100 W; Breakdown Voltage: 7.20 V; Lead-Free Status: Lead Free; REACH SVHC Compliance: No SVHC; Number of Pins: 6; Case/Package: SOT-23; Size-Width: 1.75 mm; Mounting Style: Surface Mount; Manufacturer Part Number: ESDA6V1-5SC6; Size-Height: 1.45 mm; OctopartID: 924f5b40f9684d88; Size-Length: 3.05 mm; Packaging: Tape & Reel (TR), Cut Tape (CT); Octopart URL: http://octopart.com/esda6v1-5sc6-stmicroelectronics-347713; RoHS: Compliant; Voltage Rating (DC): 6.10 V; Lifecycle Status: Active; TME: ESDA6V1-5SC6; LCSC_PN: C6650
D8 = CMP-1060-00573-1: Zener Voltage Regulator, 500 mW, 2-Pin SOD-123, Pb-Free, Tape and Reel; Manufacturer: On Semiconductor; P Max (W): 0.5; VZ Typ (V): 5.1; PackageVersion: Rev. G, 10/2009; Mounting Technology: Surface Mount; ComponentLink2Description: Datasheet; ComponentLink3URL: http://www.onsemi.com/pub_link/Collateral/425-04.PDF; PackageDescription: 2-Pin SOD, Body 1.6 x 2.69 mm; Packing: Tape and Reel; ComponentLink2URL: http://www.onsemi.com/pub_link/Collateral/MMSZ5221BT1-D.PDF; ComponentLink1URL: http://www.onsemi.com/; PartNumber: MMSZ5231BT1G; PackageReference: SOD-123-2-425-04; RoHS: Pb-Free; ComponentLink1Description: Manufacturer URL; ComponentLink3Description: Package Specification; DatasheetVersion: Rev. 12; LCSC_PN: C2759896
R10-R12 R15-R18 R53 = CMP-2002-07472-1
  R10 R12: LCSC_PN: C106235
  R11: LCSC_PN: C190095
  R15 R53: LCSC_PN: C60485
  R16-R18: LCSC_PN: C106233
RF_PCB1 = CMP-e704afk8c25r4a5ypw1c-12: GSM900 and GSM1800  Frequency Bands PCB antenna; CustomComponentID: e704afk8c25r4a5ypw1c
U2 = CMP-72dbb8ea0133ad1c-5: Module: GSM/Bluetooth; GPRS; 2G; 1800MHz, 900MHz; 85.6kbps; SMD; OctopartID: 72dbb8ea0133ad1c; Manufacturer Part Number: SIM800C; Mounting Style: Surface Mount; Octopart URL: http://octopart.com/sim800c-simcom-54220430; LCSC Part: C69120; LCSC_PN: C69119
U3 = CMP-ce8f06c57f401148-2: Embedded SIM card in MFF2; DNP: DNP; LCSC_PN: C5122390

## Sheet Sensors.SchDoc: Sensors
size A3; SheetNumber: 9; SheetTotal: 9
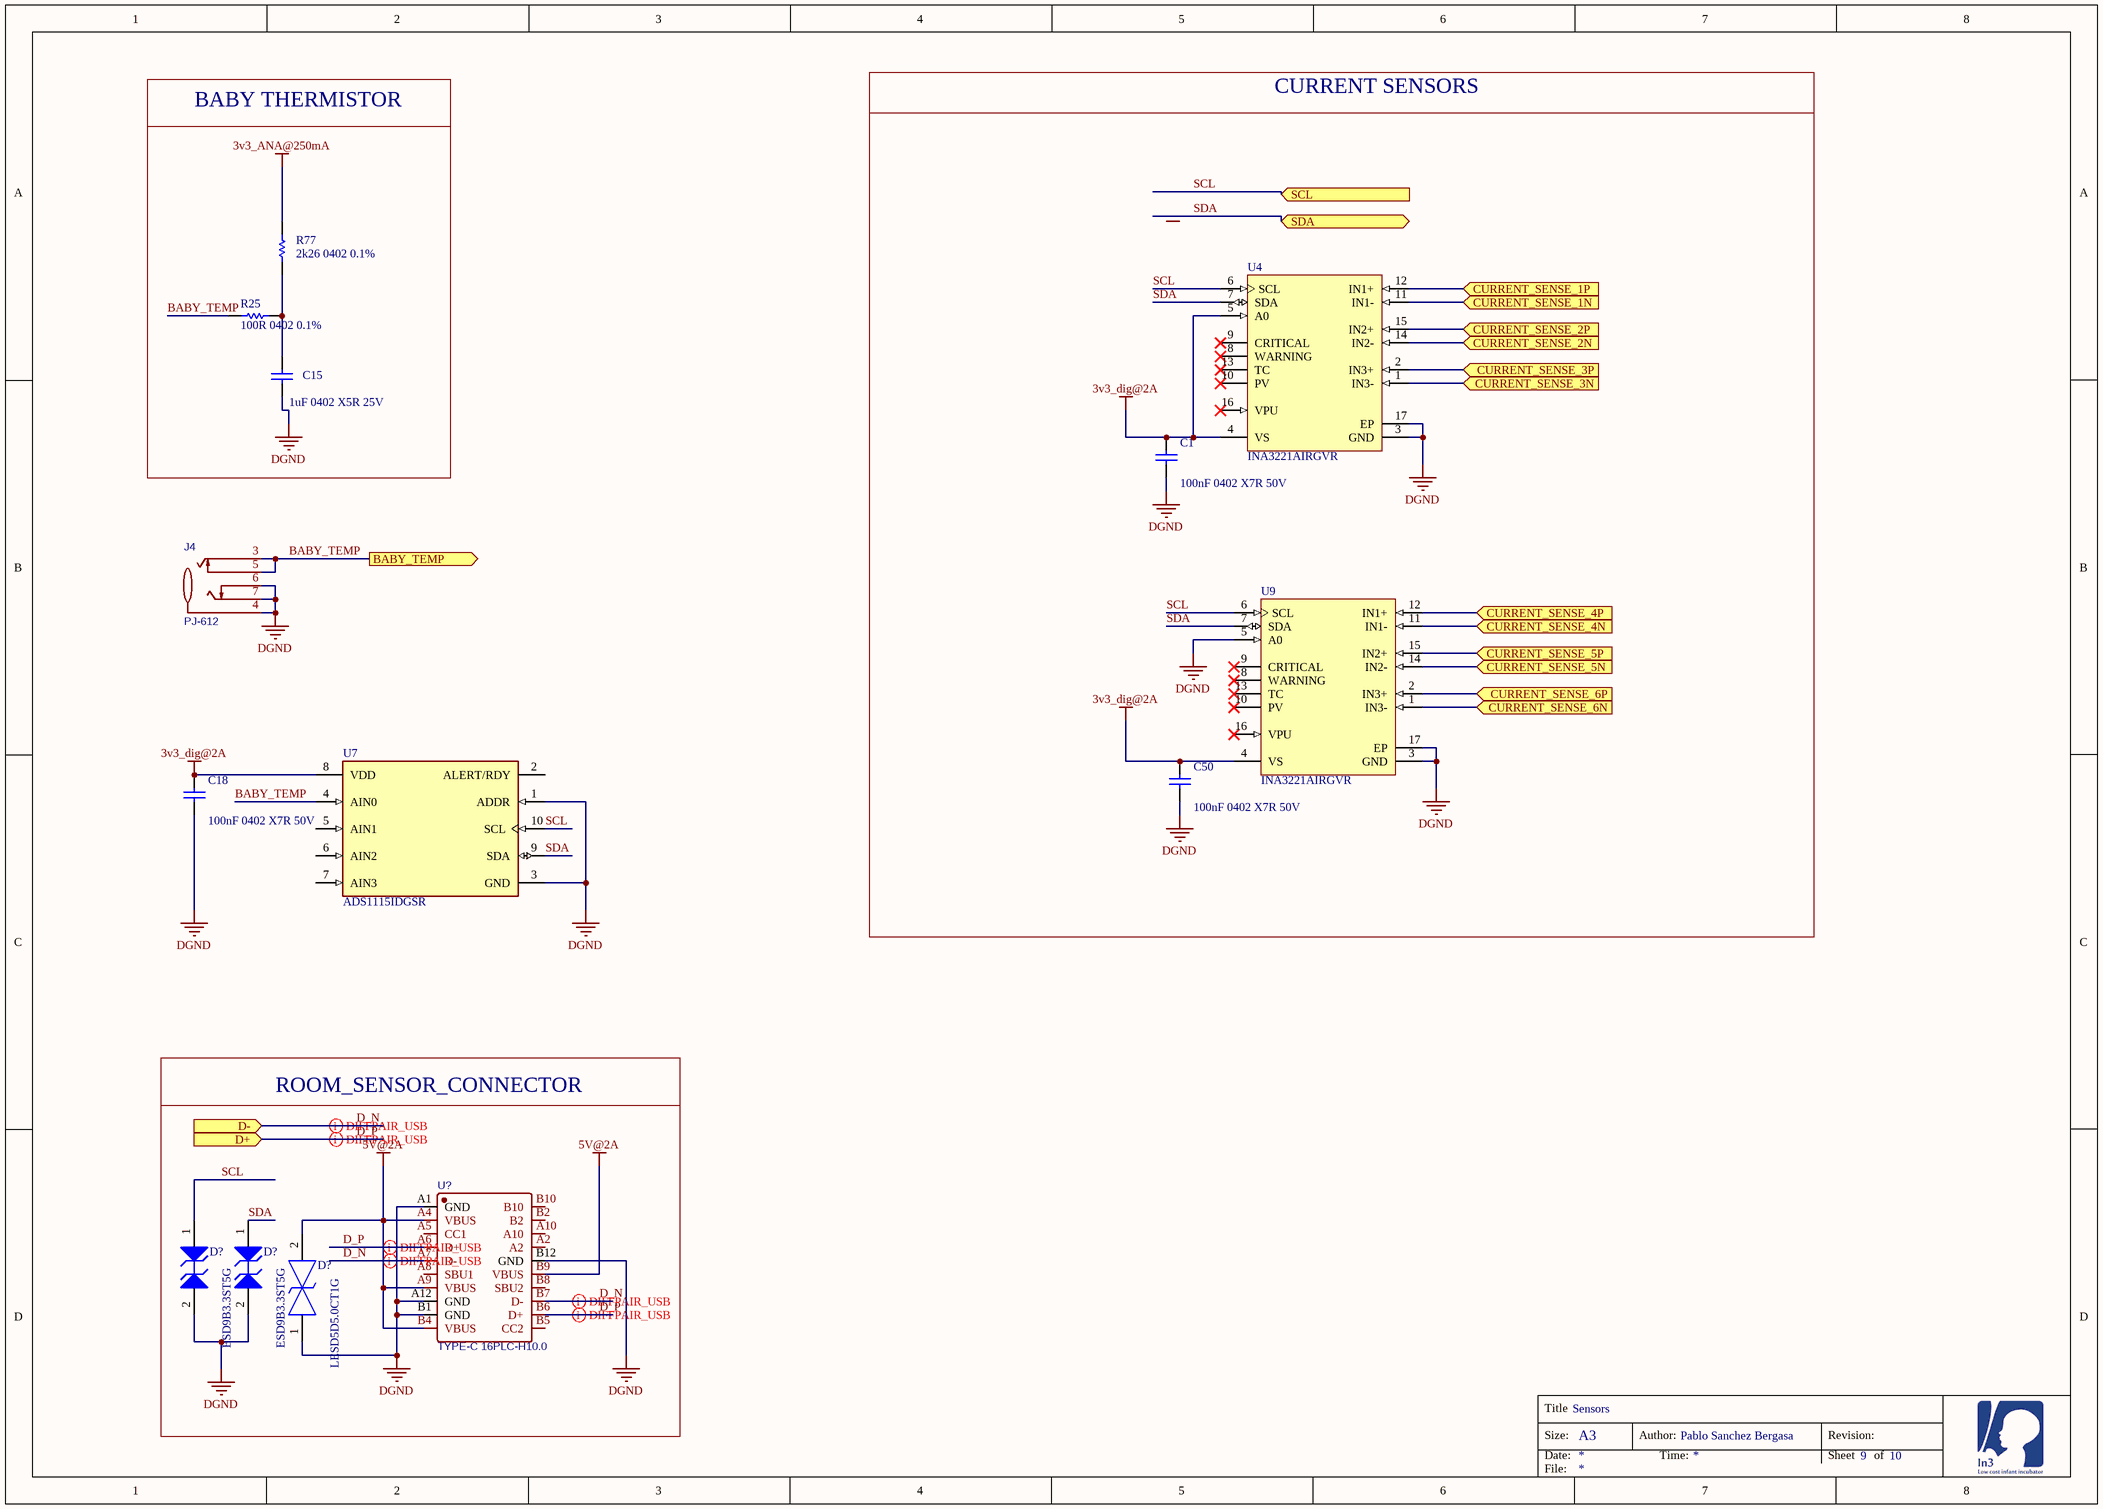
[diagram p4: Sensors.SchDoc]

### Parts
(Parts that share a designator on the sheet are numbered #1, #2 ... from top to bottom, then left to right.)
C1  100nF 0402 X7R 50V  [CAPC1005X55X25NL5T10]
C15  1uF 0402 X5R 25V  [CAPC1005X55X25NL5T10]
C18  100nF 0402 X7R 50V  [CAPC1005X55X25NL5T10]
C50  100nF 0402 X7R 50V  [CAPC1005X55X25NL5T10]
D?#1  ESD9B3.3ST5G  [ONSC-SOD-923-2-514AB-01_V]
D?#2  ESD9B3.3ST5G  [ONSC-SOD-923-2-514AB-01_V]
D?#3  LESD5D5.0CT1G  [LESD5D50CT1G]
J4  PJ-612  [AUDIO-TH_PJ-612]
R25  100R 0402 0.1%  [RESC1005X40X25ML05T10]
R77  2k26 0402 0.1%  [RESC1005X40X25ML05T10]
U4  INA3221AIRGVR  [RGV0016A_V]
U7  ADS1115IDGSR  [FP-DGS0010A-IPC_B]
U9  INA3221AIRGVR  [RGV0016A_V]
U?#2  TYPE-C 16PLC-H10.0  [TYPE-C-TH_16PLC-H10.0]

### Blocks framed on the sheet
BABY THERMISTOR: C15 R25 R77
CURRENT SENSORS: C1 C50 U4 U9
ROOM_SENSOR_CONNECTOR: D?#1-D?#3 U?#2

### Ports
BABY_TEMP (out), CURRENT_SENSE_1N (in), CURRENT_SENSE_1P (in), CURRENT_SENSE_2N (in), CURRENT_SENSE_2P (in), CURRENT_SENSE_3N (in), CURRENT_SENSE_3P (in), CURRENT_SENSE_4N (in), CURRENT_SENSE_4P (in), CURRENT_SENSE_5N (in), CURRENT_SENSE_5P (in), CURRENT_SENSE_6N (in), CURRENT_SENSE_6P (in), D+ (in), D- (in), SCL (in), SDA (bidir)

### Nets
3v3_ANA@250mA: R77.2
3v3_dig@2A: C1.2 C18.2 C50.2 U4.4(VS) U4.5(A0) U7.8(VDD) U9.4(VS)
5V@2A: D?#3.2 U?#2.A4(VBUS) U?#2.A9(VBUS) U?#2.B4(VBUS) U?#2.B9(VBUS)
DGND: C1.1 C15.1 C18.1 C50.1 D?#1.2(A2) D?#2.2(A2) D?#3.1 J4.4 J4.6 J4.7 U4.3(GND) U4.17(EP) U7.1(ADDR) U7.3(GND) U9.3(GND) U9.5(A0) U9.17(EP) U?#2.A1(GND) U?#2.A12(GND) U?#2.B1(GND) U?#2.B12(GND)
BABY_TEMP: J4.3 J4.5 R25.2 U7.4(AIN0) ; port BABY_TEMP
D_N: U?#2.A7(D-) U?#2.B7(D-) ; port D-
D_P: U?#2.A6(D+) U?#2.B6(D+) ; port D+
SCL: D?#1.1(A1) U4.6(SCL) U7.10(SCL) U9.6(SCL) ; port SCL
SDA: D?#2.1(A1) U4.7(SDA) U7.9(SDA) U9.7(SDA) ; port SDA
NetC15_2: C15.2 R25.1 R77.1
NetU4_1: U4.1(IN3-) ; port CURRENT_SENSE_3N
NetU4_2: U4.2(IN3+) ; port CURRENT_SENSE_3P
NetU4_11: U4.11(IN1-) ; port CURRENT_SENSE_1N
NetU4_12: U4.12(IN1+) ; port CURRENT_SENSE_1P
NetU4_14: U4.14(IN2-) ; port CURRENT_SENSE_2N
NetU4_15: U4.15(IN2+) ; port CURRENT_SENSE_2P
NetU9_1: U9.1(IN3-) ; port CURRENT_SENSE_6N
NetU9_2: U9.2(IN3+) ; port CURRENT_SENSE_6P
NetU9_11: U9.11(IN1-) ; port CURRENT_SENSE_4N
NetU9_12: U9.12(IN1+) ; port CURRENT_SENSE_4P
NetU9_14: U9.14(IN2-) ; port CURRENT_SENSE_5N
NetU9_15: U9.15(IN2+) ; port CURRENT_SENSE_5P

Not connected (* = marked no-connect by the designer): U4 8(WARNING)* 9(CRITICAL)* 10(PV)* 13(TC)* 16(VPU)*; U7 2(ALERT/RDY) 5(AIN1) 6(AIN2) 7(AIN3); U9 8(WARNING)* 9(CRITICAL)* 10(PV)* 13(TC)* 16(VPU)*; U?#2 A2 A5(CC1) A8(SBU1) A10 B2 B5(CC2) B8(SBU2) B10

### Layout directives
differential pair; differential pair class USB: D_N, D_P

### Notes on the sheet
- Title
- Size:
- Date:
- A3
- Author:
- Time:
- Revision:
- Sheet
- of
- File:

### Library data of the parts
C1 C15 C18 C50 = CMP-1662-00020-1: ComponentLink2Description: Datasheet; ComponentLink2URL: http://psearch.en.murata.com/capacitor/product/GRM155R60J105KE19%23.pdf; ComponentLink1Description: Manufacturer URL; ComponentLink1URL: http://www.murata.com/
  C1 C18 C50: LCSC_PN: C77020
  C15: LCSC_PN: C77009
D?#1 D?#2 = CMP-1063-00120-1: Transient Voltage Suppressor, Micro-Packaged Diode for ESD Protection, 2-Pin SOD-923, Pb-Free, Tape and Reel; Manufacturer: On Semiconductor; Number of Lines: 1; V(BR) Min (V): 5; VRWM Max (V): 3.3; Direction: Bidirectional; ComponentLink3URL: http://www.onsemi.com/pub_link/Collateral/514AB.PDF; PartNumber: ESD9B3.3ST5G; PackageVersion: Rev. C, 03/2011; Mounting Technology: Surface Mount; PackageReference: SOD-923-2-514AB-01; RoHS: Pb-Free; DatasheetVersion: Rev. 2; ComponentLink1URL: http://www.onsemi.com/; PackageDescription: 2-Pin SOD, Body 0.8 x 0.6 mm; ComponentLink3Description: Package Specification; ComponentLink2URL: http://www.onsemi.cn/pub_link/Collateral/ESD9B-D.PDF; IR Max (uA): 1; Packing: Tape and Reel; ComponentLink2Description: Datasheet; ComponentLink1Description: Manufacturer URL; LCSC_PN: C96512
D?#3 = LESD5D5.0CT1G: TVS Diode (Bi-directional); Manufacturer_Name: LRC; Height: 0.7mm; Manufacturer_Part_Number: LESD5D5.0CT1G; LCSC_PN: C383211
J4 = PJ-612: Manufacturer: HOOYA(皓宇电子); Contributor: LCSC; Supplier: LCSC; Supplier Part: C309284; Manufacturer Part: PJ-612; JLCPCB Part Class: Extended Part; spicePre: J; spiceSymbolName: PJ-612; LCSC_PN: C309284
R25 R77 = CMP-2002-07472-1
  R25: LCSC_PN: C106233
  R77: LCSC_PN: C852697
U4 U9 = CMP-0704-00001-2: Triple Channel Shunt and Bus Voltage Monitor, 120 dB, 2.7 to 5.5 V, -40 to 125 degC, 16-Pin VQFN (RGV), Green (RoHS & no Sb/Br), Tape and Reel; Manufacturer: Texas Instruments; Rating: Catalog; Quiescent Current (Typ): 350 uA; Gain Error (max): 0.25%; CMR (Typ): 120 dB; Offset Voltage (max): +/- 80 uV; Gain: 1 V/V; Voltage Input Range (Bus): 0 to 26 V; ComponentLink2Description: Datasheet; PackageDescription: 16-Pin Quad Flat No-lead Package, Body 4 x 4 mm, Pitch 0.65 mm; ComponentLink3URL: http://www.ti.com/lit/ds/symlink/ina3221.pdf; PartNumber: INA3221AIRGVR; Operating Supply Range: 2.7 to 5.5 V; DatasheetVersion: SBOS576A; Temperature Range: -40 to 125 degC; ComponentLink1Description: Manufacturer URL; ComponentLink1URL: http://www.ti.com/; RoHS: TRUE; ComponentLink3Description: Package Specification; Packing: Tape and Reel; Mounting Technology: Surface Mount; ComponentLink2URL: http://www.ti.com/lit/ds/symlink/ina3221.pdf; PackageVersion: SBOS576A; PackageReference: RGV0016A; LCSC_PN: C181255
U7 = CMP-0003-00385-3: IC ADC 16BIT SIGMA-DELTA 10VSSOP; Max Supply Voltage (DC): 5.5V; Resolution: 16b; Interface: I2C; Number of Inputs: 4; Sampling Rate: 860S/s; Integral Nonlinearity (INL): 1LSB; Min Supply Voltage: 2V; Polarity: Bipolar; Conversion Rate: 0.86KS/s; Supply Type: Single; Number of Converters: 1; Number of Bits: 16; Power Dissipation: 900uW; Case/Package: VSSOP; Contact Plating: Gold; RoHS Compliant: Yes; Max Operating Temperature: 125°C; Lead Free: Lead Free; Package Quantity: 2500; Series: -; Min Supply Voltage (DC): 2V; REACH SVHC: No SVHC; Packaging: Tape and Reel; Max Supply Voltage: 5.5V; Radiation Hardening: No; Min Operating Temperature: -40°C; Number of Pins: 10; Number of A/D Converters: 1; LCSC_PN: C37593
U?#2 = TYPE-C 16PLC-H10.0: Manufacturer: SHOU HAN(首韩); Contributor: lcsc; Supplier: LCSC; Supplier Part: C3151747; Manufacturer Part: TYPE-C 16PLC-H10.0; JLCPCB Part Class: Extended Part; spicePre: U; spiceSymbolName: TYPE-C 16PLC-H10.0; LCSC_PN: C3151747

## Sheet Display.SchDoc: GSM
size A4; SheetNumber: 10; SheetTotal: 10
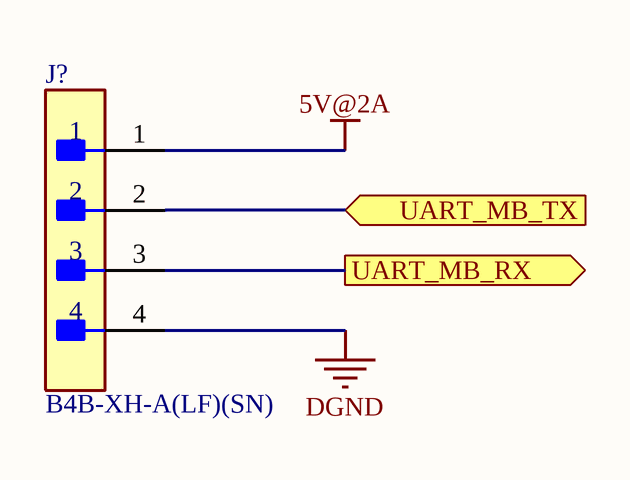
[diagram p5: Display.SchDoc]

### Parts
J?  B4B-XH-A(LF)(SN)  [FP-B4B-XH-A_LF_SN-MFG]

### Ports
UART_MB_RX (out), UART_MB_TX (in)

### Nets
5V@2A: J?.1
DGND: J?.4
NetJ?_2: J?.2 ; port UART_MB_TX
NetJ?_3: J?.3 ; port UART_MB_RX

### Notes on the sheet
- Title
- Size:
- Date:
- A3
- Author:
- Time:
- Revision:
- Sheet
- of
- File:

### Library data of the parts
J? = CMP-17439-000250-1: CONN HEADER VERT 4POS 2.5MM; Number of Contacts: 4; Contact Resistance: 20mR; Voltage Rating: 250V; Max Current Rating: 3A; Gender: Male; Wire/Cable Gauge: 22AWG; Mated Stacking Heights: 9.8mm; Insulation Resistance: 1GR; Orientation: Straight; Contact Type: Male Pin; Contact Finish - Mating: TIN; Series: XH; Max Voltage Rating (AC): 250V; Lead Pitch: 2.5mm; Contact Shape: Square; Insulation Color: Natural; Termination: Solder; Lead Free: Lead Free; Voltage Rating (AC): 250V; Number of Rows: 1; Flammability Rating: UL94 V-0; Number of Positions: 4; Max Operating Temperature: 85°C; Package Quantity: 500; Mount: Through Hole; REACH SVHC: No SVHC; Connector Type: Header; Insulation Material: Nylon; Fastening Type: Detent; Min Operating Temperature: -25°C; Housing Color: White; Packaging: Bulk; Contact Plating: Tin; Contact Material: Brass; Max Voltage Rating (DC): 250V; Housing Material: Polyamide; Color: Natural; Material: Polyamide; Pitch: 2.5mm; Depth: 5.75mm; Current Rating: 3A; Length: 12.4mm; LCSC_PN: C144395

## Nets that join several sheets
3v3_ANA@250mA: Power_management (C52.2 U16.5), AFE (6 pins), Sensors (R77.2)
3v3_dig@2A: Power_management (7 pins), AFE (C59.2 R59.2 R71.2 U17.31), Sensors (7 pins)
4V@2A: Power_management (7 pins), GSM (6 pins)
5V@2A: Power_management (9 pins), AFE (5 pins), Sensors (5 pins), Display (J?.1)
DGND: Battery (9 pins), Power_management (33 pins), AFE (25 pins), GSM (27 pins), Sensors (21 pins), Display (J?.4)
SCL: Battery (U21.13), Sensors (D?#1.1 U4.6 U7.10 U9.6)
SDA: Battery (U21.14), Sensors (D?#2.1 U4.7 U7.9 U9.7)

## Assembly variants
Main: not fitted C9 C10 C13 C33 C51 D8 J2 J5 J? L1 L2 L3 R3 R3 R7 R8 R9 R41 R48 R56 R58 R61 R63 R71 R? R? R? R? R? SW1 U8 U12 U13
NO_AFE: not fitted C9 C10 C13 C33 C54 C55 C56 C57 C58 C59 C60 C61 D28 D29 D31 D32 J14 R3 R58 R59 R60 R61 R62 R65 R66 R67 R68 R69 R71 R79 U17 Y1